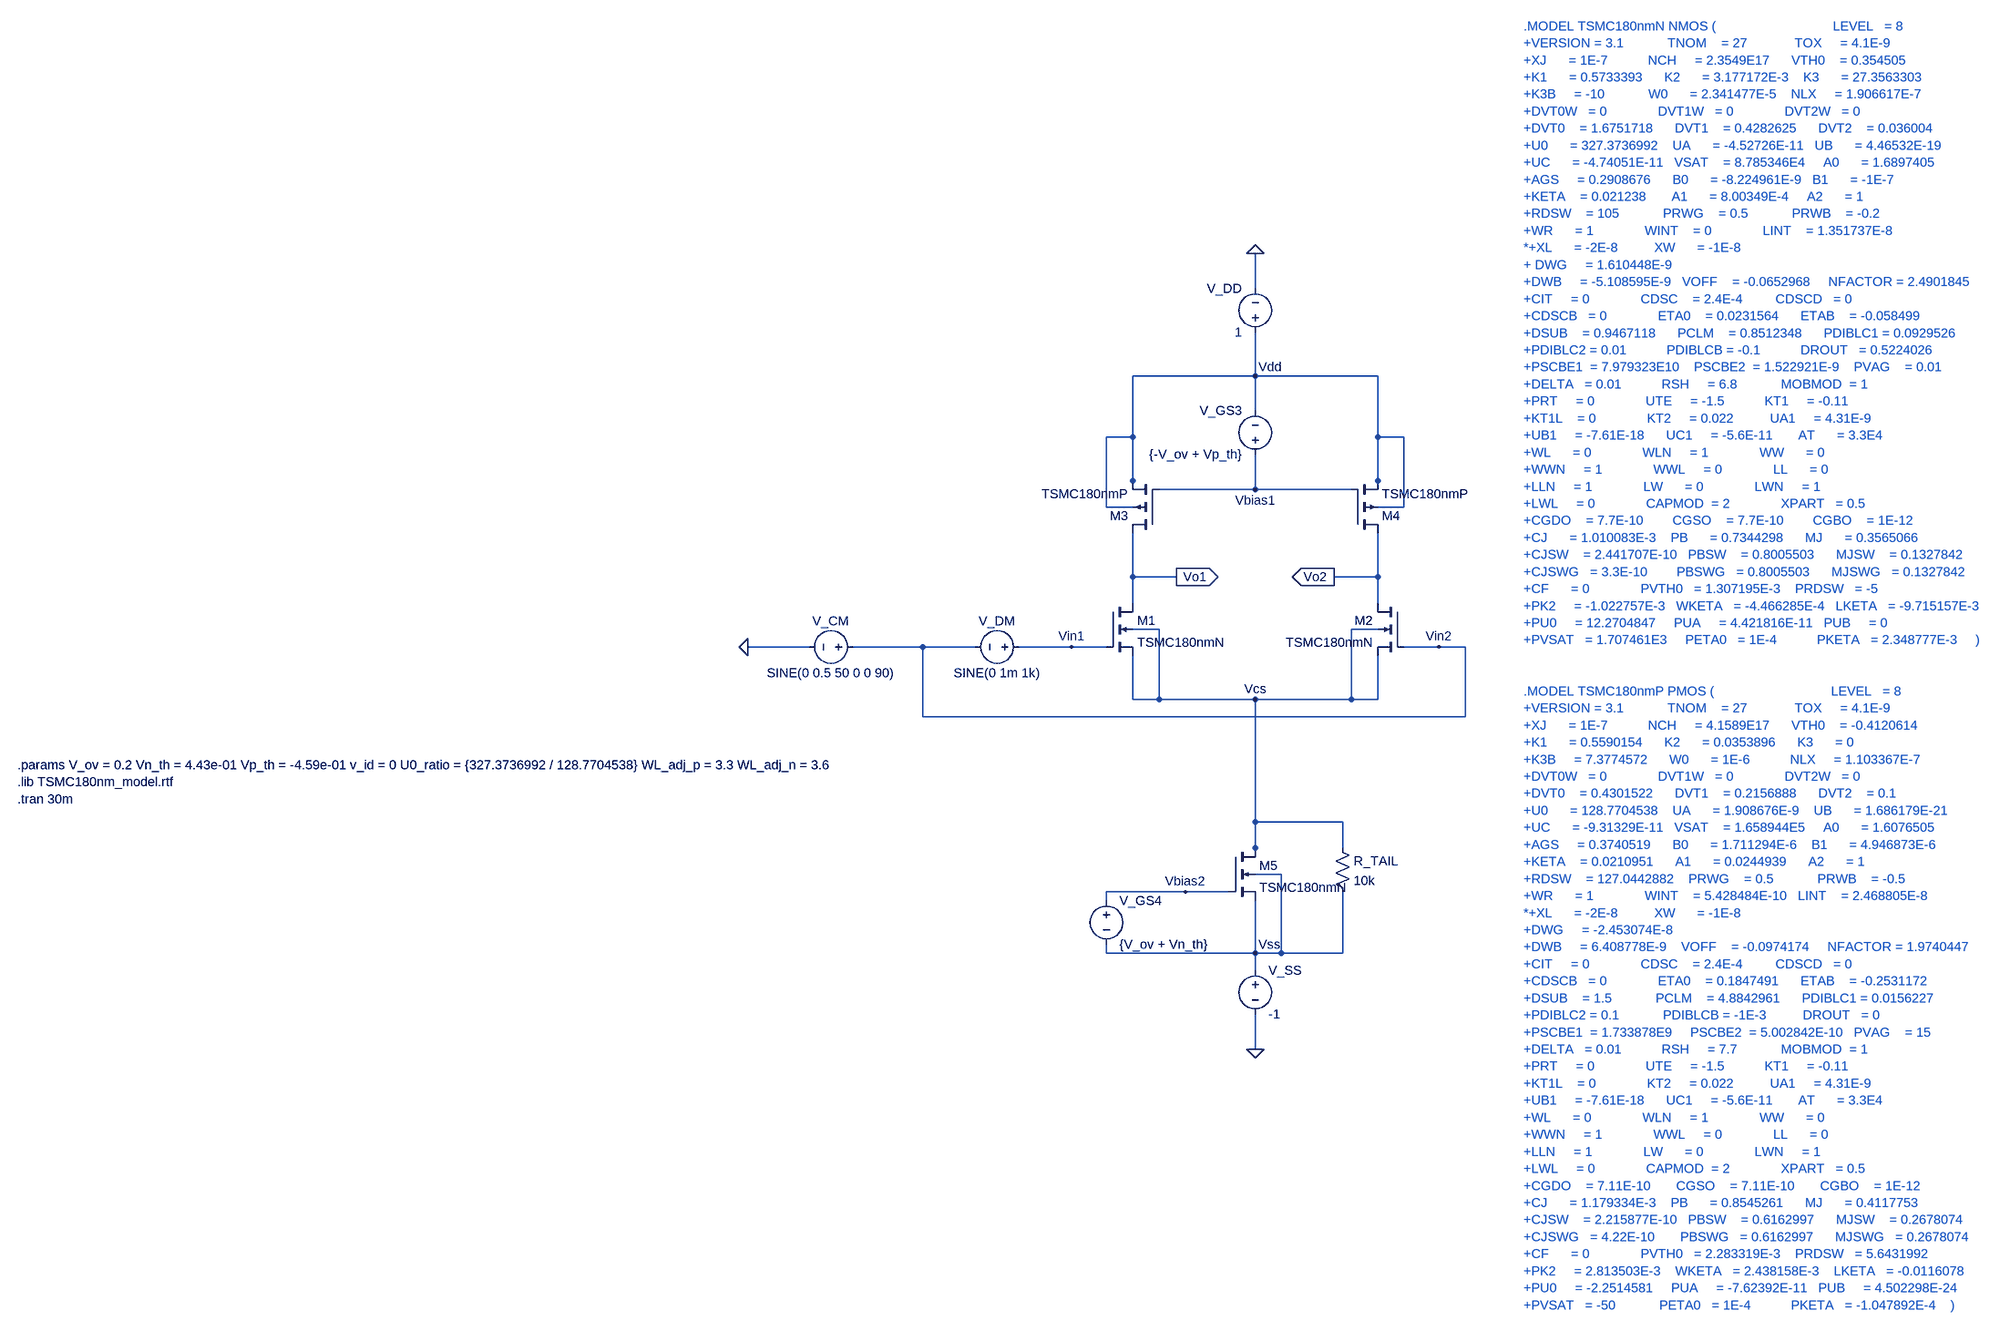
[diagram p0: schematic diff_amp_active_load_4.asc]
diff_amp_active_load_4.asc, the LTspice schematic file:
Version 4
SHEET 1 2128 1632
WIRE 368 -336 368 -400
WIRE 368 -176 368 -256
WIRE 368 -176 144 -176
WIRE 592 -176 368 -176
WIRE 368 -112 368 -176
WIRE 144 -64 144 -176
WIRE 144 -64 96 -64
WIRE 592 -64 592 -176
WIRE 640 -64 592 -64
WIRE 144 16 144 -64
WIRE 592 16 592 -64
WIRE 144 32 144 16
WIRE 368 32 368 -32
WIRE 368 32 192 32
WIRE 544 32 368 32
WIRE 592 32 592 16
WIRE 96 64 96 -64
WIRE 144 64 96 64
WIRE 640 64 640 -64
WIRE 640 64 592 64
WIRE 144 192 144 112
WIRE 224 192 144 192
WIRE 592 192 592 112
WIRE 592 192 512 192
WIRE 144 240 144 192
WIRE 592 240 592 192
WIRE 192 288 144 288
WIRE 592 288 544 288
WIRE -448 320 -560 320
WIRE -240 320 -368 320
WIRE -144 320 -240 320
WIRE 32 320 -64 320
WIRE 96 320 32 320
WIRE 704 320 640 320
WIRE 752 320 704 320
WIRE 144 416 144 336
WIRE 192 416 192 288
WIRE 192 416 144 416
WIRE 368 416 192 416
WIRE 544 416 544 288
WIRE 544 416 368 416
WIRE 592 416 592 336
WIRE 592 416 544 416
WIRE -240 448 -240 320
WIRE 752 448 752 320
WIRE 752 448 -240 448
WIRE 368 640 368 416
WIRE 528 640 368 640
WIRE 368 688 368 640
WIRE 528 688 528 640
WIRE 368 704 368 688
WIRE 416 736 368 736
WIRE 240 768 96 768
WIRE 320 768 240 768
WIRE 96 784 96 768
WIRE 96 880 96 864
WIRE 368 880 368 784
WIRE 368 880 96 880
WIRE 416 880 416 736
WIRE 416 880 368 880
WIRE 528 880 528 768
WIRE 528 880 416 880
WIRE 368 912 368 880
WIRE 368 1056 368 992
FLAG 368 -400 0
FLAG 368 1056 0
FLAG 32 320 Vin1
FLAG 704 320 Vin2
FLAG 368 -176 Vdd
FLAG 368 880 Vss
FLAG 368 416 Vcs
FLAG 368 32 Vbias1
FLAG 224 192 Vo1
IOPIN 224 192 Out
FLAG 512 192 Vo2
IOPIN 512 192 Out
FLAG 240 768 Vbias2
FLAG -560 320 0
SYMBOL voltage 368 -240 R180
WINDOW 0 24 96 Left 2
WINDOW 3 24 16 Left 2
SYMATTR InstName V_DD
SYMATTR Value 1
SYMBOL voltage 368 896 R0
SYMATTR InstName V_SS
SYMATTR Value -1
SYMBOL res 512 672 R0
SYMATTR InstName R_TAIL
SYMATTR Value 10k
SYMBOL nmos4 96 240 R0
SYMATTR InstName M1
SYMATTR Value TSMC180nmN
SYMATTR Value2 l={180n * 3} w={1.958508u * WL_adj_n}
SYMBOL nmos4 640 240 M0
SYMATTR InstName M2
SYMATTR Value TSMC180nmN
SYMATTR Value2 l={180n * 3} w={1.958508u * WL_adj_n}
SYMBOL pmos4 192 112 R180
SYMATTR InstName M3
SYMATTR Value TSMC180nmP
SYMATTR Value2 l={180n * 3} w={1.958508u * 3.27 * WL_adj_p}
SYMBOL pmos4 544 112 M180
SYMATTR InstName M4
SYMATTR Value TSMC180nmP
SYMATTR Value2 l={180n * 3} w={1.958508u * 3.27 * WL_adj_p}
SYMBOL voltage 368 -16 R180
WINDOW 0 24 96 Left 2
WINDOW 3 24 16 Left 2
SYMATTR InstName V_GS3
SYMATTR Value {-V_ov + Vp_th}
SYMBOL voltage 96 768 R0
SYMATTR InstName V_GS4
SYMATTR Value {V_ov + Vn_th}
SYMBOL nmos4 320 688 R0
SYMATTR InstName M5
SYMATTR Value TSMC180nmN
SYMATTR Value2 l={180n * 3} w={1.958508u * WL_adj_n * 2}
SYMBOL voltage -352 320 R90
WINDOW 0 -32 56 VBottom 2
WINDOW 3 32 56 VTop 2
SYMATTR InstName V_CM
SYMATTR Value SINE(0 0.5 50 0 0 90)
SYMBOL voltage -48 320 R90
WINDOW 0 -32 56 VBottom 2
WINDOW 3 32 56 VTop 2
SYMATTR InstName V_DM
SYMATTR Value SINE(0 1m 1k)
TEXT -1896 536 Left 2 !.params V_ov = 0.2 Vn_th = 4.43e-01 Vp_th = -4.59e-01 v_id = 0 U0_ratio = {327.3736992 / 128.7704538} WL_adj_p = 3.3 WL_adj_n = 3.6\n.lib TSMC180nm_model.rtf\n.tran 30m
TEXT 1224 -816 Left 2 ;.MODEL TSMC180nmN NMOS (                                LEVEL   = 8\n+VERSION = 3.1            TNOM    = 27             TOX     = 4.1E-9\n+XJ      = 1E-7           NCH     = 2.3549E17      VTH0    = 0.354505\n+K1      = 0.5733393      K2      = 3.177172E-3    K3      = 27.3563303\n+K3B     = -10            W0      = 2.341477E-5    NLX     = 1.906617E-7\n+DVT0W   = 0              DVT1W   = 0              DVT2W   = 0\n+DVT0    = 1.6751718      DVT1    = 0.4282625      DVT2    = 0.036004\n+U0      = 327.3736992    UA      = -4.52726E-11   UB      = 4.46532E-19\n+UC      = -4.74051E-11   VSAT    = 8.785346E4     A0      = 1.6897405\n+AGS     = 0.2908676      B0      = -8.224961E-9   B1      = -1E-7\n+KETA    = 0.021238       A1      = 8.00349E-4     A2      = 1\n+RDSW    = 105            PRWG    = 0.5            PRWB    = -0.2\n+WR      = 1              WINT    = 0              LINT    = 1.351737E-8\n*+XL      = -2E-8          XW      = -1E-8         \n+ DWG     = 1.610448E-9\n+DWB     = -5.108595E-9   VOFF    = -0.0652968     NFACTOR = 2.4901845\n+CIT     = 0              CDSC    = 2.4E-4         CDSCD   = 0\n+CDSCB   = 0              ETA0    = 0.0231564      ETAB    = -0.058499\n+DSUB    = 0.9467118      PCLM    = 0.8512348      PDIBLC1 = 0.0929526\n+PDIBLC2 = 0.01           PDIBLCB = -0.1           DROUT   = 0.5224026\n+PSCBE1  = 7.979323E10    PSCBE2  = 1.522921E-9    PVAG    = 0.01\n+DELTA   = 0.01           RSH     = 6.8            MOBMOD  = 1\n+PRT     = 0              UTE     = -1.5           KT1     = -0.11\n+KT1L    = 0              KT2     = 0.022          UA1     = 4.31E-9\n+UB1     = -7.61E-18      UC1     = -5.6E-11       AT      = 3.3E4\n+WL      = 0              WLN     = 1              WW      = 0\n+WWN     = 1              WWL     = 0              LL      = 0\n+LLN     = 1              LW      = 0              LWN     = 1\n+LWL     = 0              CAPMOD  = 2              XPART   = 0.5\n+CGDO    = 7.7E-10        CGSO    = 7.7E-10        CGBO    = 1E-12\n+CJ      = 1.010083E-3    PB      = 0.7344298      MJ      = 0.3565066\n+CJSW    = 2.441707E-10   PBSW    = 0.8005503      MJSW    = 0.1327842\n+CJSWG   = 3.3E-10        PBSWG   = 0.8005503      MJSWG   = 0.1327842\n+CF      = 0              PVTH0   = 1.307195E-3    PRDSW   = -5\n+PK2     = -1.022757E-3   WKETA   = -4.466285E-4   LKETA   = -9.715157E-3\n+PU0     = 12.2704847     PUA     = 4.421816E-11   PUB     = 0\n+PVSAT   = 1.707461E3     PETA0   = 1E-4           PKETA   = 2.348777E-3     )\n \n\n.MODEL TSMC180nmP PMOS (                                LEVEL   = 8\n+VERSION = 3.1            TNOM    = 27             TOX     = 4.1E-9\n+XJ      = 1E-7           NCH     = 4.1589E17      VTH0    = -0.4120614\n+K1      = 0.5590154      K2      = 0.0353896      K3      = 0\n+K3B     = 7.3774572      W0      = 1E-6           NLX     = 1.103367E-7\n+DVT0W   = 0              DVT1W   = 0              DVT2W   = 0\n+DVT0    = 0.4301522      DVT1    = 0.2156888      DVT2    = 0.1\n+U0      = 128.7704538    UA      = 1.908676E-9    UB      = 1.686179E-21\n+UC      = -9.31329E-11   VSAT    = 1.658944E5     A0      = 1.6076505\n+AGS     = 0.3740519      B0      = 1.711294E-6    B1      = 4.946873E-6\n+KETA    = 0.0210951      A1      = 0.0244939      A2      = 1\n+RDSW    = 127.0442882    PRWG    = 0.5            PRWB    = -0.5\n+WR      = 1              WINT    = 5.428484E-10   LINT    = 2.468805E-8\n*+XL      = -2E-8          XW      = -1E-8          \n+DWG     = -2.453074E-8\n+DWB     = 6.408778E-9    VOFF    = -0.0974174     NFACTOR = 1.9740447\n+CIT     = 0              CDSC    = 2.4E-4         CDSCD   = 0\n+CDSCB   = 0              ETA0    = 0.1847491      ETAB    = -0.2531172\n+DSUB    = 1.5            PCLM    = 4.8842961      PDIBLC1 = 0.0156227\n+PDIBLC2 = 0.1            PDIBLCB = -1E-3          DROUT   = 0\n+PSCBE1  = 1.733878E9     PSCBE2  = 5.002842E-10   PVAG    = 15\n+DELTA   = 0.01           RSH     = 7.7            MOBMOD  = 1\n+PRT     = 0              UTE     = -1.5           KT1     = -0.11\n+KT1L    = 0              KT2     = 0.022          UA1     = 4.31E-9\n+UB1     = -7.61E-18      UC1     = -5.6E-11       AT      = 3.3E4\n+WL      = 0              WLN     = 1              WW      = 0\n+WWN     = 1              WWL     = 0              LL      = 0\n+LLN     = 1              LW      = 0              LWN     = 1\n+LWL     = 0              CAPMOD  = 2              XPART   = 0.5\n+CGDO    = 7.11E-10       CGSO    = 7.11E-10       CGBO    = 1E-12\n+CJ      = 1.179334E-3    PB      = 0.8545261      MJ      = 0.4117753\n+CJSW    = 2.215877E-10   PBSW    = 0.6162997      MJSW    = 0.2678074\n+CJSWG   = 4.22E-10       PBSWG   = 0.6162997      MJSWG   = 0.2678074\n+CF      = 0              PVTH0   = 2.283319E-3    PRDSW   = 5.6431992\n+PK2     = 2.813503E-3    WKETA   = 2.438158E-3    LKETA   = -0.0116078\n+PU0     = -2.2514581     PUA     = -7.62392E-11   PUB     = 4.502298E-24\n+PVSAT   = -50            PETA0   = 1E-4           PKETA   = -1.047892E-4    )

The netlist it stands for:
* diff_amp_active_load_4.asc
V_DD Vdd 0 1
V_SS Vss 0 -1
R_TAIL Vcs Vss 10k
M1 Vo1 Vin1 Vcs Vcs TSMC180nmN l={180n * 3} w={1.958508u * WL_adj_n}
M2 Vo2 Vin2 Vcs Vcs TSMC180nmN l={180n * 3} w={1.958508u * WL_adj_n}
M3 Vo1 Vbias1 Vdd Vdd TSMC180nmP l={180n * 3} w={1.958508u * 3.27 * WL_adj_p}
M4 Vo2 Vbias1 Vdd Vdd TSMC180nmP l={180n * 3} w={1.958508u * 3.27 * WL_adj_p}
V_GS3 Vbias1 Vdd {-V_ov + Vp_th}
V_GS4 Vbias2 Vss {V_ov + Vn_th}
M5 Vcs Vbias2 Vss Vss TSMC180nmN l={180n * 3} w={1.958508u * WL_adj_n * 2}
V_CM Vin2 0 SINE(0 0.5 50 0 0 90)
V_DM Vin1 Vin2 SINE(0 1m 1k)
.model NMOS NMOS
.model PMOS PMOS
.lib standard.mos
.params V_ov = 0.2 Vn_th = 4.43e-01 Vp_th = -4.59e-01 v_id = 0 U0_ratio = {327.3736992 / 128.7704538} WL_adj_p = 3.3 WL_adj_n = 3.6
.lib TSMC180nm_model.rtf
.tran 30m
* .MODEL TSMC180nmN NMOS (                                LEVEL   = 8
* +VERSION = 3.1            TNOM    = 27             TOX     = 4.1E-9
* +XJ      = 1E-7           NCH     = 2.3549E17      VTH0    = 0.354505
* +K1      = 0.5733393      K2      = 3.177172E-3    K3      = 27.3563303
* +K3B     = -10            W0      = 2.341477E-5    NLX     = 1.906617E-7
* +DVT0W   = 0              DVT1W   = 0              DVT2W   = 0
* +DVT0    = 1.6751718      DVT1    = 0.4282625      DVT2    = 0.036004
* +U0      = 327.3736992    UA      = -4.52726E-11   UB      = 4.46532E-19
* +UC      = -4.74051E-11   VSAT    = 8.785346E4     A0      = 1.6897405
* +AGS     = 0.2908676      B0      = -8.224961E-9   B1      = -1E-7
* +KETA    = 0.021238       A1      = 8.00349E-4     A2      = 1
* +RDSW    = 105            PRWG    = 0.5            PRWB    = -0.2
* +WR      = 1              WINT    = 0              LINT    = 1.351737E-8
* *+XL      = -2E-8          XW      = -1E-8
* + DWG     = 1.610448E-9
* +DWB     = -5.108595E-9   VOFF    = -0.0652968     NFACTOR = 2.4901845
* +CIT     = 0              CDSC    = 2.4E-4         CDSCD   = 0
* +CDSCB   = 0              ETA0    = 0.0231564      ETAB    = -0.058499
* +DSUB    = 0.9467118      PCLM    = 0.8512348      PDIBLC1 = 0.0929526
* +PDIBLC2 = 0.01           PDIBLCB = -0.1           DROUT   = 0.5224026
* +PSCBE1  = 7.979323E10    PSCBE2  = 1.522921E-9    PVAG    = 0.01
* +DELTA   = 0.01           RSH     = 6.8            MOBMOD  = 1
* +PRT     = 0              UTE     = -1.5           KT1     = -0.11
* +KT1L    = 0              KT2     = 0.022          UA1     = 4.31E-9
* +UB1     = -7.61E-18      UC1     = -5.6E-11       AT      = 3.3E4
* +WL      = 0              WLN     = 1              WW      = 0
* +WWN     = 1              WWL     = 0              LL      = 0
* +LLN     = 1              LW      = 0              LWN     = 1
* +LWL     = 0              CAPMOD  = 2              XPART   = 0.5
* +CGDO    = 7.7E-10        CGSO    = 7.7E-10        CGBO    = 1E-12
* +CJ      = 1.010083E-3    PB      = 0.7344298      MJ      = 0.3565066
* +CJSW    = 2.441707E-10   PBSW    = 0.8005503      MJSW    = 0.1327842
* +CJSWG   = 3.3E-10        PBSWG   = 0.8005503      MJSWG   = 0.1327842
* +CF      = 0              PVTH0   = 1.307195E-3    PRDSW   = -5
* +PK2     = -1.022757E-3   WKETA   = -4.466285E-4   LKETA   = -9.715157E-3
* +PU0     = 12.2704847     PUA     = 4.421816E-11   PUB     = 0
* +PVSAT   = 1.707461E3     PETA0   = 1E-4           PKETA   = 2.348777E-3     )
* .MODEL TSMC180nmP PMOS (                                LEVEL   = 8
* +VERSION = 3.1            TNOM    = 27             TOX     = 4.1E-9
* +XJ      = 1E-7           NCH     = 4.1589E17      VTH0    = -0.4120614
* +K1      = 0.5590154      K2      = 0.0353896      K3      = 0
* +K3B     = 7.3774572      W0      = 1E-6           NLX     = 1.103367E-7
* +DVT0W   = 0              DVT1W   = 0              DVT2W   = 0
* +DVT0    = 0.4301522      DVT1    = 0.2156888      DVT2    = 0.1
* +U0      = 128.7704538    UA      = 1.908676E-9    UB      = 1.686179E-21
* +UC      = -9.31329E-11   VSAT    = 1.658944E5     A0      = 1.6076505
* +AGS     = 0.3740519      B0      = 1.711294E-6    B1      = 4.946873E-6
* +KETA    = 0.0210951      A1      = 0.0244939      A2      = 1
* +RDSW    = 127.0442882    PRWG    = 0.5            PRWB    = -0.5
* +WR      = 1              WINT    = 5.428484E-10   LINT    = 2.468805E-8
* *+XL      = -2E-8          XW      = -1E-8
* +DWG     = -2.453074E-8
* +DWB     = 6.408778E-9    VOFF    = -0.0974174     NFACTOR = 1.9740447
* +CIT     = 0              CDSC    = 2.4E-4         CDSCD   = 0
* +CDSCB   = 0              ETA0    = 0.1847491      ETAB    = -0.2531172
* +DSUB    = 1.5            PCLM    = 4.8842961      PDIBLC1 = 0.0156227
* +PDIBLC2 = 0.1            PDIBLCB = -1E-3          DROUT   = 0
* +PSCBE1  = 1.733878E9     PSCBE2  = 5.002842E-10   PVAG    = 15
* +DELTA   = 0.01           RSH     = 7.7            MOBMOD  = 1
* +PRT     = 0              UTE     = -1.5           KT1     = -0.11
* +KT1L    = 0              KT2     = 0.022          UA1     = 4.31E-9
* +UB1     = -7.61E-18      UC1     = -5.6E-11       AT      = 3.3E4
* +WL      = 0              WLN     = 1              WW      = 0
* +WWN     = 1              WWL     = 0              LL      = 0
* +LLN     = 1              LW      = 0              LWN     = 1
* +LWL     = 0              CAPMOD  = 2              XPART   = 0.5
* +CGDO    = 7.11E-10       CGSO    = 7.11E-10       CGBO    = 1E-12
* +CJ      = 1.179334E-3    PB      = 0.8545261      MJ      = 0.4117753
* +CJSW    = 2.215877E-10   PBSW    = 0.6162997      MJSW    = 0.2678074
* +CJSWG   = 4.22E-10       PBSWG   = 0.6162997      MJSWG   = 0.2678074
* +CF      = 0              PVTH0   = 2.283319E-3    PRDSW   = 5.6431992
* +PK2     = 2.813503E-3    WKETA   = 2.438158E-3    LKETA   = -0.0116078
* +PU0     = -2.2514581     PUA     = -7.62392E-11   PUB     = 4.502298E-24
* +PVSAT   = -50            PETA0   = 1E-4           PKETA   = -1.047892E-4    )
.backanno
.end